# Altium schematic sheet chess_module_connectors.SchDoc
size A; SheetNumber: 3; SheetTotal: 3
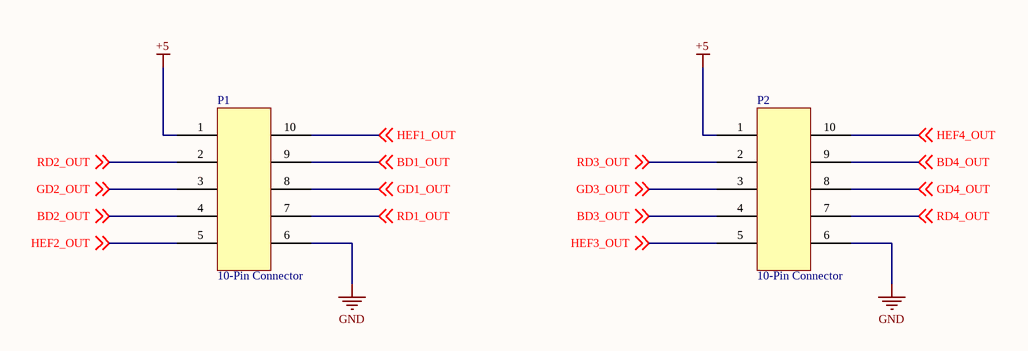
[diagram p0: chess_module_connectors.SchDoc]

## Parts
P1  10-Pin Connector
P2  10-Pin Connector

## Nets
+5: P1.1 P2.1
GND: P1.6 P2.6
BD1_OUT: P1.9 ; off-sheet BD1_OUT
BD2_OUT: P1.4 ; off-sheet BD2_OUT
BD3_OUT: P2.4 ; off-sheet BD3_OUT
BD4_OUT: P2.9 ; off-sheet BD4_OUT
GD1_OUT: P1.8 ; off-sheet GD1_OUT
GD2_OUT: P1.3 ; off-sheet GD2_OUT
GD3_OUT: P2.3 ; off-sheet GD3_OUT
GD4_OUT: P2.8 ; off-sheet GD4_OUT
HEF1_OUT: P1.10 ; off-sheet HEF1_OUT
HEF2_OUT: P1.5 ; off-sheet HEF2_OUT
HEF3_OUT: P2.5 ; off-sheet HEF3_OUT
HEF4_OUT: P2.10 ; off-sheet HEF4_OUT
RD1_OUT: P1.7 ; off-sheet RD1_OUT
RD2_OUT: P1.2 ; off-sheet RD2_OUT
RD3_OUT: P2.2 ; off-sheet RD3_OUT
RD4_OUT: P2.7 ; off-sheet RD4_OUT